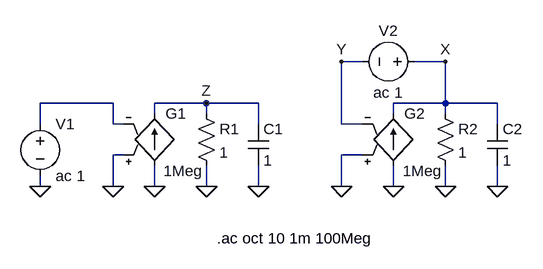
[diagram p0: schematic Loop1.asc]
Loop1.asc, the LTspice schematic file:
Version 4
SHEET 1 1180 680
WIRE 336 272 336 240
WIRE 336 368 336 352
WIRE 448 240 336 240
WIRE 448 272 448 240
WIRE 448 368 448 320
WIRE 464 272 448 272
WIRE 464 320 448 320
WIRE 512 256 512 240
WIRE 512 368 512 336
WIRE 592 240 512 240
WIRE 592 256 592 240
WIRE 592 368 592 336
WIRE 672 240 592 240
WIRE 672 272 672 240
WIRE 672 368 672 336
WIRE 800 272 800 176
WIRE 800 368 800 320
WIRE 832 176 800 176
WIRE 832 272 800 272
WIRE 832 320 800 320
WIRE 880 256 880 240
WIRE 880 368 880 336
WIRE 960 176 912 176
WIRE 960 240 880 240
WIRE 960 240 960 176
WIRE 960 256 960 240
WIRE 960 368 960 336
WIRE 1040 240 960 240
WIRE 1040 272 1040 240
WIRE 1040 368 1040 336
FLAG 592 368 0
FLAG 672 368 0
FLAG 512 368 0
FLAG 448 368 0
FLAG 336 368 0
FLAG 960 368 0
FLAG 1040 368 0
FLAG 880 368 0
FLAG 800 368 0
FLAG 960 176 X
FLAG 800 176 Y
FLAG 592 240 Z
SYMBOL res 576 240 R0
SYMATTR InstName R1
SYMATTR Value 1
SYMBOL cap 656 272 R0
SYMATTR InstName C1
SYMATTR Value 1
SYMBOL voltage 336 256 R0
SYMATTR InstName V1
SYMATTR Value ac 1
SYMBOL g2 512 240 R0
WINDOW 0 17 16 Left 0
WINDOW 3 14 104 Left 0
SYMATTR InstName G1
SYMATTR Value 1Meg
SYMBOL res 944 240 R0
SYMATTR InstName R2
SYMATTR Value 1
SYMBOL cap 1024 272 R0
SYMATTR InstName C2
SYMATTR Value 1
SYMBOL g2 880 240 R0
WINDOW 0 17 16 Left 0
WINDOW 3 14 104 Left 0
SYMATTR InstName G2
SYMATTR Value 1Meg
SYMBOL voltage 928 176 R90
WINDOW 0 -32 56 VBottom 0
WINDOW 3 32 56 VTop 0
SYMATTR InstName V2
SYMATTR Value ac 1
TEXT 608 448 Left 0 !.ac oct 10 1m 100Meg

The netlist it stands for:
* Loop1.asc
R1 Z 0 1
C1 Z 0 1
V1 N001 0 ac 1
G1 0 Z 0 N001 1Meg
R2 X 0 1
C2 X 0 1
G2 0 X 0 Y 1Meg
V2 X Y ac 1
.ac oct 10 1m 100Meg
.backanno
.end